# Altium schematic sheet Schematic.SchDoc
size A; SheetNumber: 1; SheetTotal: 1
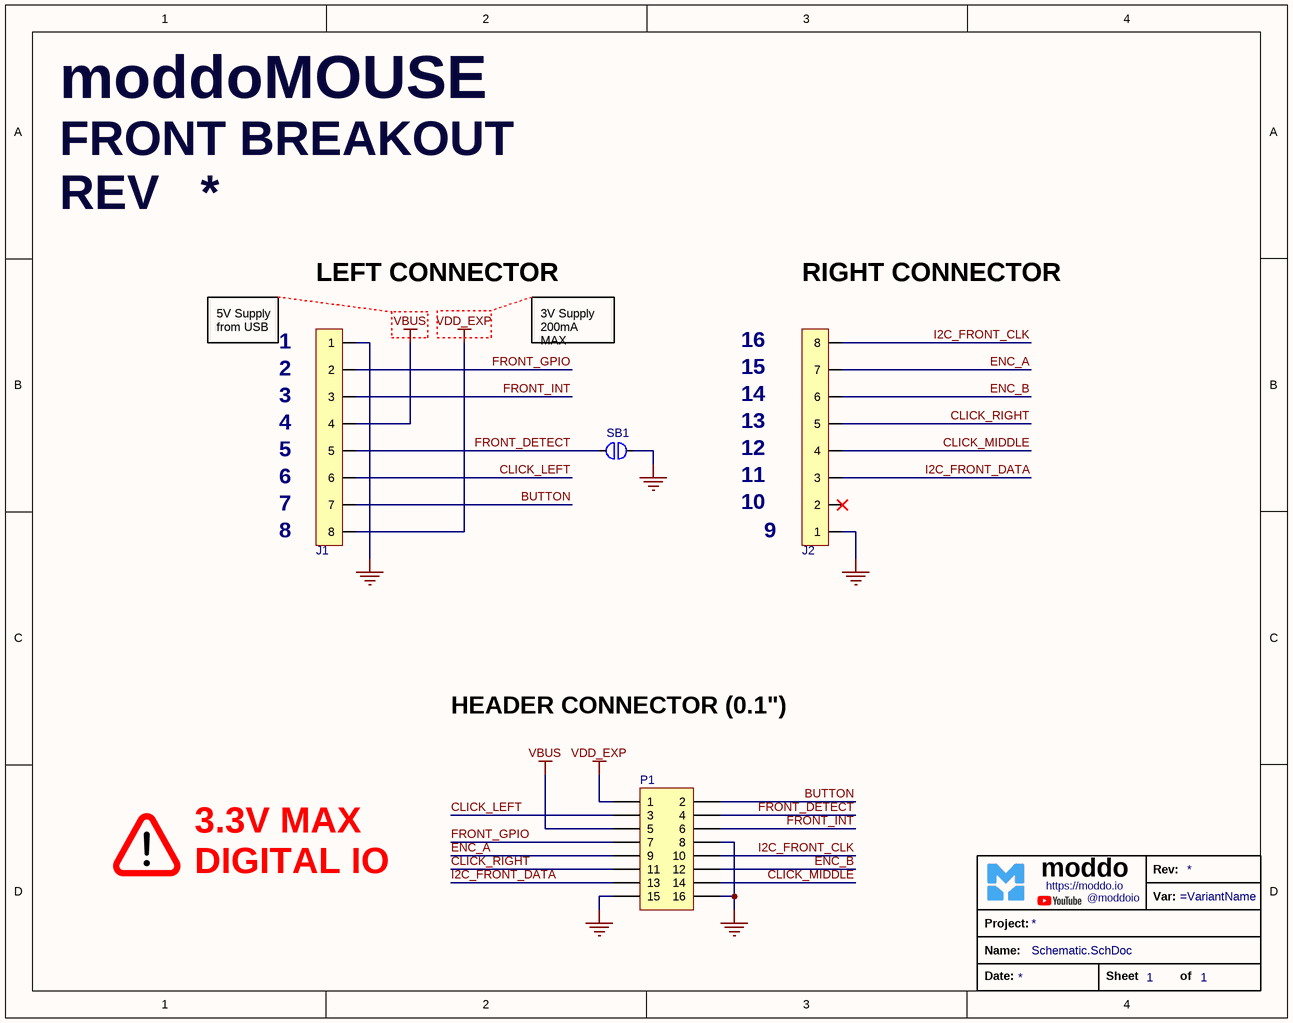
[diagram p0: Schematic.SchDoc]

## Parts
?  TitleBlock_moddo  (value not drawn)  (graphical)
J1  1.27mm_8pins  [1.27mm_8pins_MaleHeader]  (value not drawn)
J2  1.27mm_8pins  [1.27mm_8pins_MaleHeader]  (value not drawn)
P1  Header 8X2  [HEADER_2_54_F_2X8]  (value not drawn)
SB1  Solderbridge  [Solderbridge]  (value not drawn)  (no BOM)

## Nets
GND: J1.1 J2.1 P1.8 P1.15 P1.16 SB1.1
VBUS: J1.4 P1.5
VDD_EXP: J1.8 P1.1
BUTTON: J1.7 P1.2
CLICK_LEFT: J1.6 P1.3
CLICK_MIDDLE: J2.4 P1.14
CLICK_RIGHT: J2.5 P1.11
ENC_A: J2.7 P1.9
ENC_B: J2.6 P1.12
FRONT_DETECT: J1.5 P1.4 SB1.2
FRONT_GPIO: J1.2 P1.7
FRONT_INT: J1.3 P1.6
I2C_FRONT_CLK: J2.8 P1.10
I2C_FRONT_DATA: J2.3 P1.13

Not connected (* = marked no-connect by the designer): J2 2*

## Notes on the sheet
- moddoMOUSE <https://protorig.io/>
- FRONT BREAKOUT <https://protorig.io/>
- REV
- LEFT CONNECTOR
- RIGHT CONNECTOR
- 5V Supply
  from USB
- (near J1) 1
- 3V Supply
  200mA MAX
- (near J2) 16
- (near J1) 4
- (near J1) 3
- (near J1) 2
- (near J2) 13
- (near J2) 14
- (near J2) 15
- (near J1) 6
- (near J1) 5
- (near J2) 11
- (near J2) 12
- (near J1) 8
- (near J1) 7
- (near J2) 10
- (near J2) 9
- HEADER CONNECTOR (0.1")
- 3.3V MAX
- DIGITAL IO
- (in symbol TitleBlock_moddo) Rev:; moddo; https://moddo.io; Var:; @moddoio; Project:; Name:; Date:; Sheet; of

## Library data of the parts
P1 = Header 8X2: Header, 8-Pin, Dual row; Manufacturer: Adam Tech; Manufacturer Part Number: RS2-16-G; LatestRevisionDate: 17-Jul-2002; LatestRevisionNote: Re-released for DXP Platform.; Publisher: Altium Limited
SB1 = SOLDERBRIDGE: Artikkelnr Noca: N.A.; Part Number: Solderbridge; Manufacturer: *; Manufacturer Part Number: *; Datasheet: *; LatestRevisionDate: 2009-12-14; Pin Count: 2; Publisher: Nordic Semiconductor; Published: 2009-12-14; Value: Solderbridge; Note: *; Supplier: *; Supplier part number: *; 2nd source Supplier: *; 2nd source part number: *; Footprint Doc: Solderbridge; Artikkelnr Simpro: N.A.